# EAGLE schematic bugs (EAGLE 9.1.1)
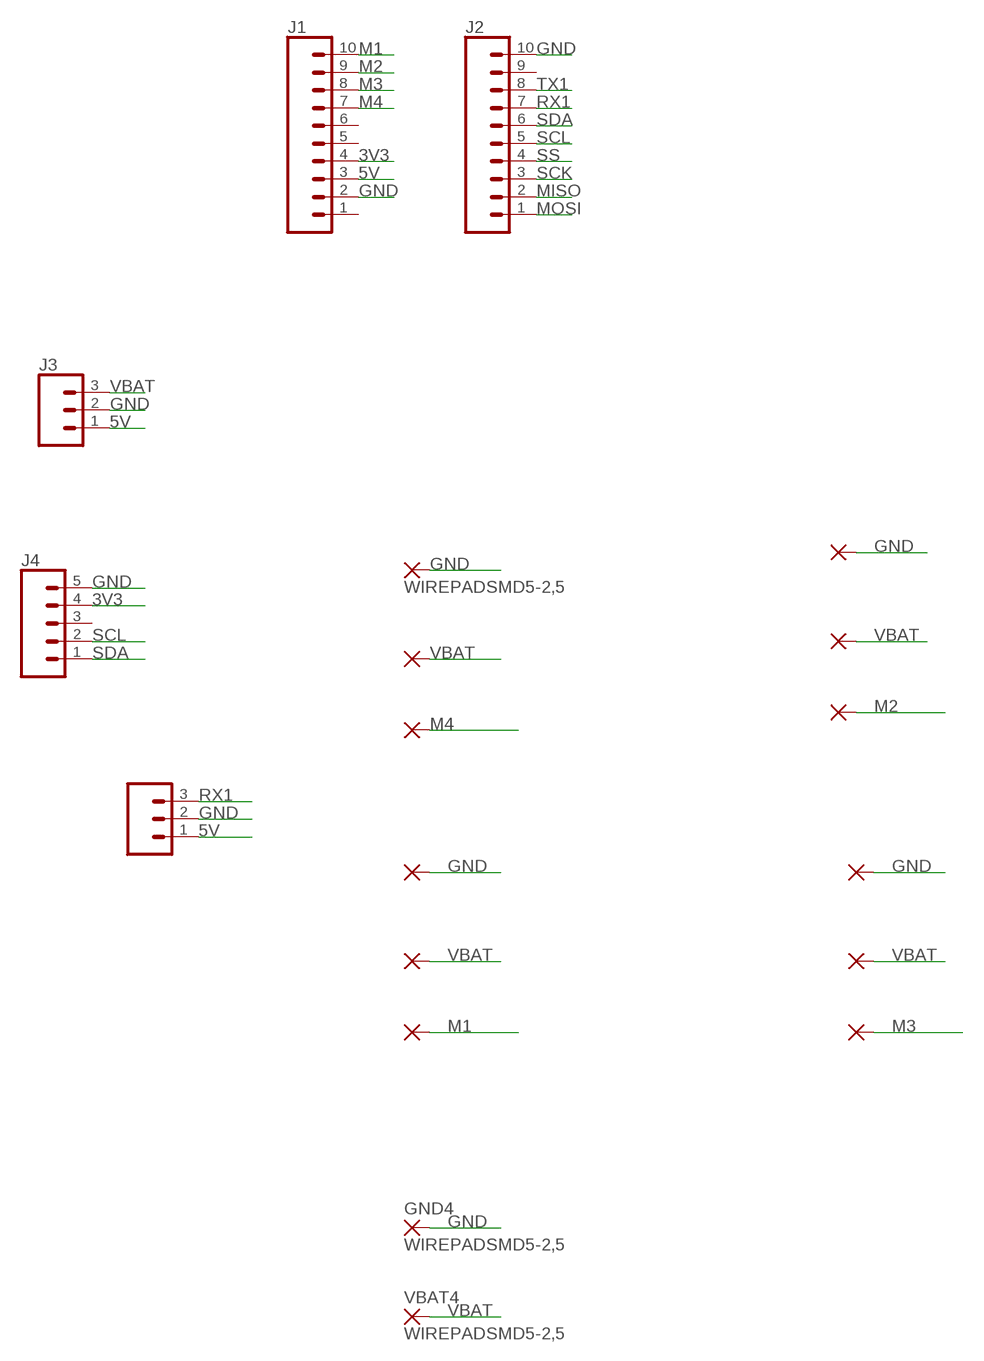
[diagram p0: schematic, sheet 1]

## Parts
GND  WIREPADSMD5-2,5  [5-2,5]
GND1  WIREPADSMD5-2,5  [5-2,5]
GND2  WIREPADSMD5-2,5  [5-2,5]
GND3  WIREPADSMD5-2,5  [5-2,5]
GND4  WIREPADSMD5-2,5  [5-2,5]
J1  CONN_10NO_SILK_PTH_FEMALE  [1X10_NO_SILK]
J2  CONN_10NO_SILK_PTH_FEMALE  [1X10_NO_SILK]
J3  CONN_031X03_NO_SILK  [1X03_NO_SILK]
J4  CONN_05NO_SILK  [1X05_NO_SILK]
J5  CONN_031X03_NO_SILK  [1X03_NO_SILK]
M1  WIREPADSMD5-2,5  [5-2,5]
M2  WIREPADSMD5-2,5  [5-2,5]
M3  WIREPADSMD5-2,5  [5-2,5]
M4  WIREPADSMD5-2,5  [5-2,5]
VBAT  WIREPADSMD5-2,5  [5-2,5]
VBAT1  WIREPADSMD5-2,5  [5-2,5]
VBAT2  WIREPADSMD5-2,5  [5-2,5]
VBAT3  WIREPADSMD5-2,5  [5-2,5]
VBAT4  WIREPADSMD5-2,5  [5-2,5]

## Nets
3V3: J1.4 J4.4
5V: J1.3 J3.1 J5.1
GND: GND1.1(P) GND2.1(P) GND3.1(P) GND4.1(P) GND.1(P) J1.2 J2.10 J3.2 J4.5 J5.2
M1: J1.10 M1.1(P)
M2: J1.9 M2.1(P)
M3: J1.8 M3.1(P)
M4: J1.7 M4.1(P)
MISO: J2.2
MOSI: J2.1
RX1: J2.7 J5.3
SCK: J2.3
SCL: J2.5 J4.2
SDA: J2.6 J4.1
SS: J2.4
TX1: J2.8
VBAT: J3.3 VBAT1.1(P) VBAT2.1(P) VBAT3.1(P) VBAT4.1(P) VBAT.1(P)
Unconnected: J1.1 J1.5 J1.6 J2.9 J4.3

## Library data of the parts
GND GND1-GND4 M1-M4 VBAT VBAT1-VBAT4 = wirepad:WIREPAD: Wire PAD connect wire on PCB
J1 J2 = SparkFun-Connectors:CONN_10: Multi connection point. Often used as Generic Header-pin footprint for 0.1 inch spaced/style header connections On any of the 0.1 inch spaced packages, you can populate with these: Break Away Headers - Straight <https://www.sparkfun.com/products/116> (PRT-00116) Break Away Male Headers - Right Angle <https://www.sparkfun.com/products/553> (PRT-00553) Female Headers <https://www.sparkfun.com/products/115> (PRT-00115) Break Away Headers - Machine Pin <https://www.sparkfun.com/products/117> (PRT-00117) Break Away Female Headers - Swiss Machine Pin <https://www.sparkfun.com/products/743> (PRT-00743) Arduino Stackable Header - 10 Pin <https://www.sparkfun.com/products/11376> (PRT-11376) For SCREWTERMINALS and SPRING TERMINALS visit here: Screw Terimnals on SparkFun.com <https://www.sparkfun.com/search/results?term=Screw+Terminals> (5mm/3.5mm/2.54mm spacing) This device is also useful as a general connection point to wire up your design to another part of your project. Our various solder wires solder well into these plated through hole pads. Hook-Up Wire - Assortment (Stranded, 22 AWG) <https://www.sparkfun.com/products/11375> (PRT-11375) Hook-Up Wire - Assortment (Solid Core, 22 AWG) <https://www.sparkfun.com/products/11367> (PRT-11367) View the entire wire category on our website here <https://www.sparkfun.com/categories/141> Special notes: Molex polarized connector foot print use with SKU : PRT-08231 with associated crimp pins and housings. 1MM SMD Version SKU: PRT-10208 NOTES ON THE VARIANTS LOCK and LOCK_LONGPADS... This footprint was designed to help hold the alignment of a through-hole component (i.e. 6-pin header) while soldering it into place. You may notice that each hole has been shifted either up or down by 0.005 of an inch from it's more standard position (which is a perfectly straight line). This slight alteration caused the pins (the squares in the middle) to touch the edges of the holes. Because they are alternating, it causes a "brace" to hold the component in place. 0.005 has proven to be the perfect amount of "off-center" position when using our standard breakaway headers. Although looks a little odd when you look at the bare footprint, once you have a header in there, the alteration is very hard to notice. Also,if you push a header all the way into place, it is covered up entirely on the bottom side.
J3 J5 = SparkFun-Connectors:CONN_03: Multi connection point. Often used as Generic Header-pin footprint for 0.1 inch spaced/style header connections On any of the 0.1 inch spaced packages, you can populate with these: Break Away Headers - Straight <https://www.sparkfun.com/products/116> (PRT-00116) Break Away Male Headers - Right Angle <https://www.sparkfun.com/products/553> (PRT-00553) Female Headers <https://www.sparkfun.com/products/115> (PRT-00115) Break Away Headers - Machine Pin <https://www.sparkfun.com/products/117> (PRT-00117) Break Away Female Headers - Swiss Machine Pin <https://www.sparkfun.com/products/743> (PRT-00743) Stackable Header - 3 Pin (Female, 0.1") <https://www.sparkfun.com/products/13875> (PRT-13875) For SCREWTERMINALS and SPRING TERMINALS visit here: Screw Terimnals on SparkFun.com <https://www.sparkfun.com/search/results?term=Screw+Terminals> (5mm/3.5mm/2.54mm spacing) This device is also useful as a general connection point to wire up your design to another part of your project. Our various solder wires solder well into these plated through hole pads. Hook-Up Wire - Assortment (Stranded, 22 AWG) <https://www.sparkfun.com/products/11375> (PRT-11375) Hook-Up Wire - Assortment (Solid Core, 22 AWG) <https://www.sparkfun.com/products/11367> (PRT-11367) View the entire wire category on our website here <https://www.sparkfun.com/categories/141> Special notes: Molex polarized connector foot print use with SKU : PRT-08232 with associated crimp pins and housings.
J4 = SparkFun-Connectors:CONN_05: Multi connection point. Often used as Generic Header-pin footprint for 0.1 inch spaced/style header connections On any of the 0.1 inch spaced packages, you can populate with these: Break Away Headers - Straight <https://www.sparkfun.com/products/116> (PRT-00116) Break Away Male Headers - Right Angle <https://www.sparkfun.com/products/553> (PRT-00553) Female Headers <https://www.sparkfun.com/products/115> (PRT-00115) Break Away Headers - Machine Pin <https://www.sparkfun.com/products/117> (PRT-00117) Break Away Female Headers - Swiss Machine Pin <https://www.sparkfun.com/products/743> (PRT-00743) For SCREWTERMINALS and SPRING TERMINALS visit here: Screw Terimnals on SparkFun.com <https://www.sparkfun.com/search/results?term=Screw+Terminals> (5mm/3.5mm/2.54mm spacing) This device is also useful as a general connection point to wire up your design to another part of your project. Our various solder wires solder well into these plated through hole pads. Hook-Up Wire - Assortment (Stranded, 22 AWG) <https://www.sparkfun.com/products/11375> (PRT-11375) Hook-Up Wire - Assortment (Solid Core, 22 AWG) <https://www.sparkfun.com/products/11367> (PRT-11367) View the entire wire category on our website here <https://www.sparkfun.com/categories/141> Special notes: Molex polarized connector foot print use with SKU : PRT-08231 with associated crimp pins and housings. 1MM SMD Version SKU: PRT-10208